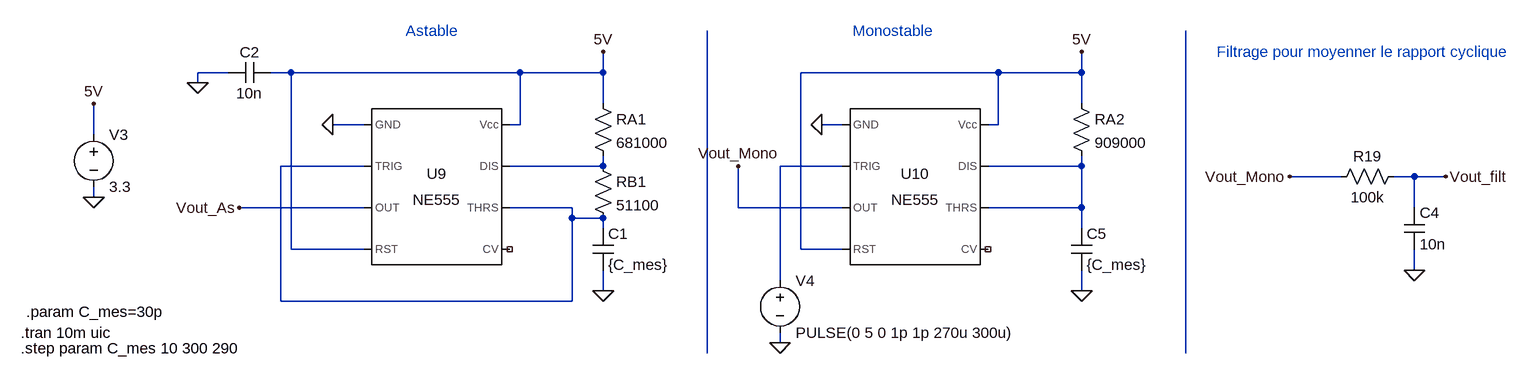
[diagram p0: schematic Capacitif.asc]
Capacitif.asc, the LTspice schematic file:
Version 4
SHEET 1 4952 816
WIRE 720 0 672 0
WIRE 816 0 784 0
WIRE 1168 0 816 0
WIRE 1296 0 1296 -32
WIRE 1296 0 1168 0
WIRE 1904 0 1600 0
WIRE 2032 0 2032 -32
WIRE 2032 0 1904 0
WIRE 672 16 672 0
WIRE 1296 48 1296 0
WIRE 2032 48 2032 0
WIRE 928 80 880 80
WIRE 1168 80 1168 0
WIRE 1168 80 1152 80
WIRE 1664 80 1632 80
WIRE 1904 80 1904 0
WIRE 1904 80 1888 80
WIRE 512 96 512 48
WIRE 928 144 800 144
WIRE 1296 144 1296 128
WIRE 1296 144 1152 144
WIRE 1664 144 1568 144
WIRE 2032 144 2032 128
WIRE 2032 144 1888 144
WIRE 2432 160 2352 160
WIRE 2544 160 2512 160
WIRE 2592 160 2544 160
WIRE 512 192 512 176
WIRE 928 208 736 208
WIRE 1248 208 1152 208
WIRE 1504 208 1504 144
WIRE 1664 208 1504 208
WIRE 2032 208 2032 144
WIRE 2032 208 1888 208
WIRE 2544 208 2544 160
WIRE 1248 224 1248 208
WIRE 1296 224 1248 224
WIRE 1296 240 1296 224
WIRE 2032 240 2032 208
WIRE 816 272 816 0
WIRE 928 272 816 272
WIRE 1600 272 1600 0
WIRE 1664 272 1600 272
WIRE 2544 304 2544 272
WIRE 1568 320 1568 144
WIRE 1296 336 1296 304
WIRE 2032 336 2032 304
WIRE 800 352 800 144
WIRE 1248 352 1248 224
WIRE 1248 352 800 352
WIRE 1568 416 1568 400
WIRE 1456 432 1456 -64
WIRE 2192 432 2192 -64
FLAG 1296 336 0
FLAG 512 48 5V
FLAG 880 80 0
FLAG 512 192 0
FLAG 672 16 0
FLAG 2032 336 0
FLAG 2032 -32 5V
FLAG 1632 80 0
FLAG 1296 -32 5V
FLAG 736 208 Vout_As
FLAG 1568 416 0
FLAG 2544 304 0
FLAG 2592 160 Vout_filt
FLAG 1504 144 Vout_Mono
FLAG 2352 160 Vout_Mono
SYMBOL Misc\\NE555 1040 176 R0
SYMATTR InstName U9
SYMBOL cap 1280 240 R0
SYMATTR InstName C1
SYMATTR Value {C_mes}
SYMBOL voltage 512 80 R0
WINDOW 123 0 0 Left 0
WINDOW 39 0 0 Left 0
SYMATTR InstName V3
SYMATTR Value 3.3
SYMBOL res 1280 128 R0
SYMATTR InstName RB1
SYMATTR Value 51100
SYMBOL res 1280 32 R0
SYMATTR InstName RA1
SYMATTR Value 681000
SYMBOL cap 784 -16 R90
WINDOW 0 0 32 VBottom 2
WINDOW 3 32 32 VTop 2
SYMATTR InstName C2
SYMATTR Value 10n
SYMBOL Misc\\NE555 1776 176 R0
SYMATTR InstName U10
SYMBOL res 2016 32 R0
SYMATTR InstName RA2
SYMATTR Value 909000
SYMBOL voltage 1568 304 R0
WINDOW 123 0 0 Left 0
WINDOW 39 0 0 Left 0
SYMATTR InstName V4
SYMATTR Value PULSE(0 5 0 1p 1p 270u 300u)
SYMBOL res 2528 144 R90
WINDOW 0 0 56 VBottom 2
WINDOW 3 32 56 VTop 2
SYMATTR InstName R19
SYMATTR Value 100k
SYMBOL cap 2528 208 R0
SYMATTR InstName C4
SYMATTR Value 10n
SYMBOL cap 2016 240 R0
SYMATTR InstName C5
SYMATTR Value {C_mes}
TEXT 400 400 Left 2 !.tran 10m uic
TEXT 400 424 Left 2 !.step param C_mes 10 300 290
TEXT 408 368 Left 2 !.param C_mes=30p
TEXT 992 -64 Left 2 ;Astable
TEXT 1680 -64 Left 2 ;Monostable
TEXT 2240 -32 Left 2 ;Filtrage pour moyenner le rapport cyclique

The netlist it stands for:
* Capacitif.asc
XU9 0 N001 Vout_As 5V NC_01 N001 N002 5V NE555  ; pins GND TRIG OUT RST CV THRS DIS Vcc
C1 N001 0 {C_mes}
V3 5V 0 3.3
RB1 N002 N001 51100
RA1 5V N002 681000
C2 5V 0 10n
XU10 0 N003 Vout_Mono 5V NC_02 N004 N004 5V NE555  ; pins GND TRIG OUT RST CV THRS DIS Vcc
RA2 5V N004 909000
V4 N003 0 PULSE(0 5 0 1p 1p 270u 300u)
R19 Vout_filt Vout_Mono 100k
C4 Vout_filt 0 10n
C5 N004 0 {C_mes}
.tran 10m uic
.step param C_mes 10 300 290
.param C_mes=30p
* Astable
* Monostable
* Filtrage pour moyenner le rapport cyclique
.lib NE555.sub
.backanno
.end